# EAGLE design 4_TTL (EAGLE 7.6.0)
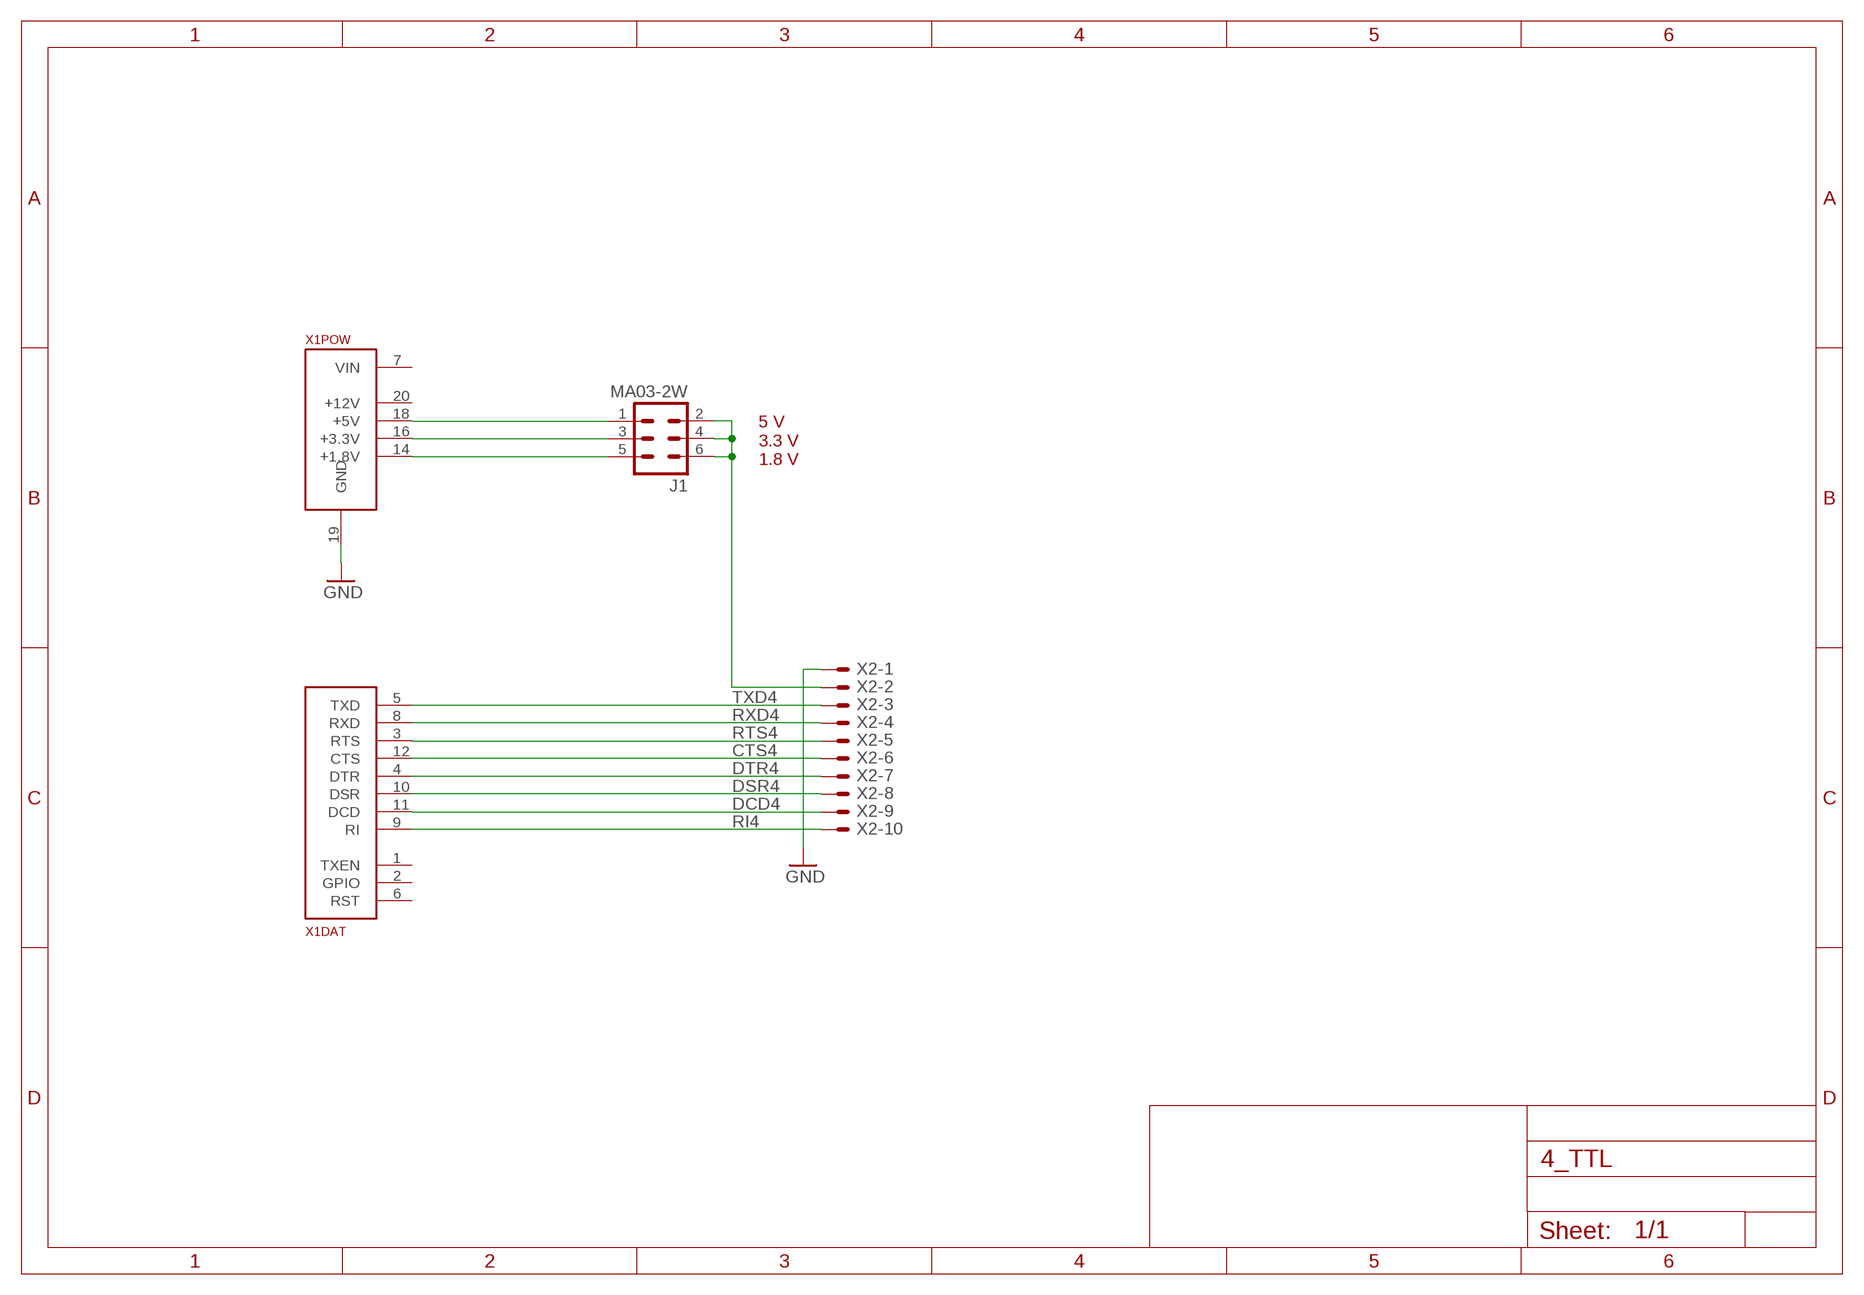
[diagram p0: schematic, sheet 1]

## Parts
J1  MA03-2W  [MA03-2W]
X1  ALLSERIALD  [DAUGHTER-THT]
X2  AKL18X-10W  [AKL182-10]

## Nets
CTS4: X1.12(DAT:CTS) X2.P$6
DCD4: X1.11(DAT:DCD) X2.P$9
DSR4: X1.10(DAT:DSR) X2.P$8
DTR4: X1.4(DAT:DTR) X2.P$7
GND: X1.19(POW:GND) X2.P$1
N$1: J1.2 J1.4 J1.6 X2.P$2
N$2: J1.5 X1.14(POW:+1.8V)
N$3: J1.3 X1.16(POW:+3.3V)
N$4: J1.1 X1.18(POW:+5V)
RI4: X1.9(DAT:RI) X2.P$10
RTS4: X1.3(DAT:RTS) X2.P$5
RXD4: X1.8(DAT:RXD) X2.P$4
TXD4: X1.5(DAT:TXD) X2.P$3
Unconnected: X1.1(DAT:TXEN) X1.2(DAT:GPIO) X1.6(DAT:RST) X1.7(POW:VIN) X1.20(POW:+12V)

## Notes on the sheet
- 5 V
  3.3 V
  1.8 V

## Library data of the parts
J1 = con-lstb:MA03-2W
X1 = AllSerial:ALLSERIAL
X2 = con-riacon_akl:AKL18X-10: Riacon AKL18X Steckverbinder 10-Pol Grid = 3,5mm

## Board
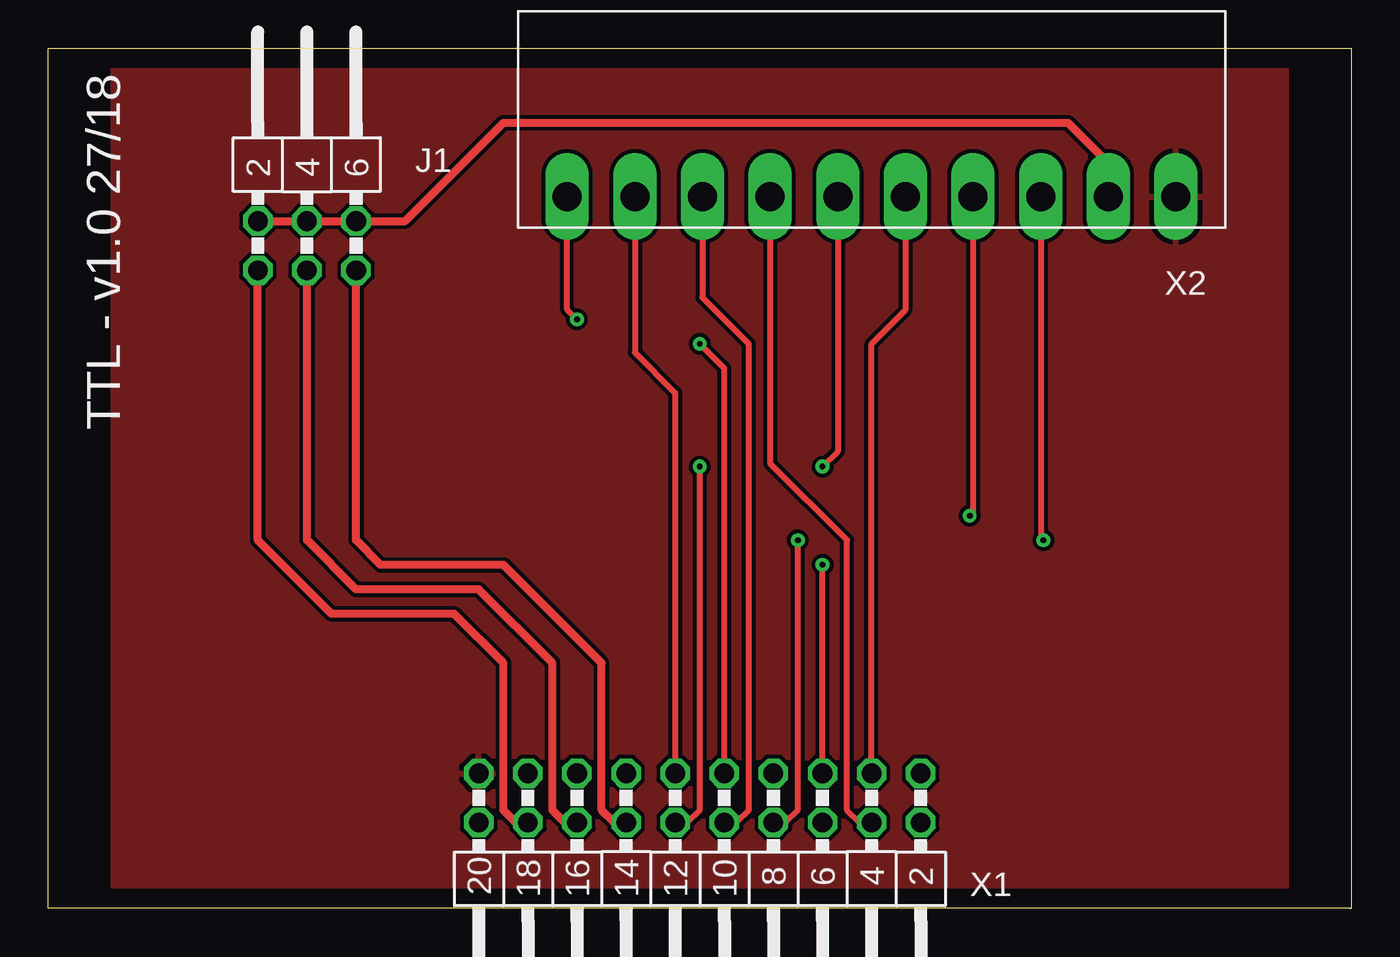
[diagram p1: board, top side]
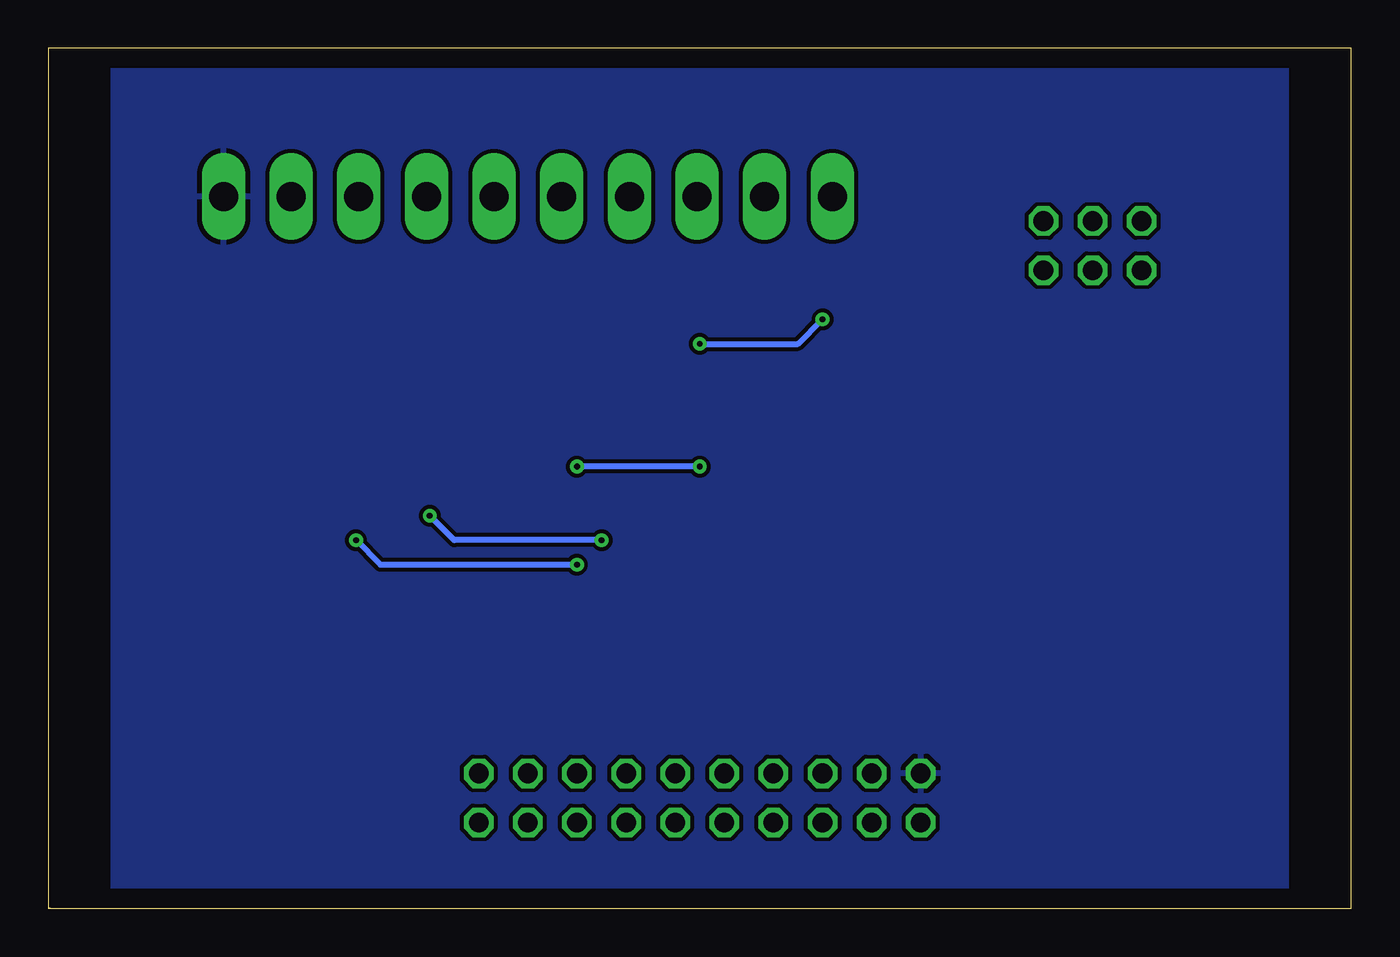
[diagram p2: board, bottom side, seen from below]

Size 67.4 x 44.5 mm. Coordinates in mm from the lower left corner, seen from the top.
Outline: 67.31,0 67.4,0
Copper layers (1*16): Top 0.035mm / dielectric 1.5mm / Bottom 0.035mm
Design rules "default *": minimum track width 10mil, minimum drill 24mil, track to track 8mil, track to pad 8mil, pad to pad 8mil, via to via 8mil, smd to smd 8mil, copper to edge 40mil, drill to drill 8mil, minimum pad ring 10mil, minimum via ring 8mil, stop-mask expansion 4mil, vias tented up to drill 0.3mm, thermal gap 10mil

### Footprints (pad centres in the part's own frame; a part is rotated, then mirrored left to right if it is on the bottom)
MA03-2W = drill 1.016 octagon: 1 -2.54,-1.27; 2 -2.54,1.27; 3 0,-1.27; 4 0,1.27; 5 2.54,-1.27; 6 2.54,1.27
DAUGHTER-THT = drill 1.016 octagon: 1 11.43,6.985; 2 11.43,4.445; 3 8.89,6.985; 4 8.89,4.445; 5 6.35,6.985; 6 6.35,4.445; 7 3.81,6.985; 8 3.81,4.445; 9 1.27,6.985; 10 1.27,4.445; 11 -1.27,6.985; 12 -1.27,4.445; 13 -3.81,6.985; 14 -3.81,4.445; 15 -6.35,6.985; 16 -6.35,4.445; 17 -8.89,6.985; 18 -8.89,4.445; 19 -11.43,6.985; 20 -11.43,4.445
AKL182-10 = drill 1.5 pad 2.184 long: P$1 -15.75,0; P$2 -12.25,0; P$3 -8.75,0; P$4 -5.25,0; P$5 -1.75,0; P$6 1.75,0; P$7 5.25,0; P$8 8.75,0; P$9 12.25,0; P$10 15.75,0

### Placement (x,y rotation side)
J1  13.38,34.29 0 top
X1  33.7,0 0 top
X2  42.59,36.83 180 top

### Tracks (layer width: path | path; a pad name or v marks a point on that pad's centre or on a via)
CTS4  (via drill 0.3)
  Top 0.305: X2.P$6 40.84,23.65 v40.05,22.86 | X1.12 33.07,4.45 33.7,5.08 v33.7,22.86
  Bottom 0.305: v33.7,22.86 v40.05,22.86
DCD4
  Top 0.305: X2.P$9 30.34,28.76 32.43,26.67 X1.11
DSR4
  Top 0.305: X1.10 35.61,4.45 36.24,5.08 36.24,29.21 33.84,31.61 X2.P$8
DTR4
  Top 0.305: X1.4 41.96,4.45 41.32,5.08 41.32,19.05 37.34,23.03 X2.P$7
GND
  pour Bottom: -0.59,44.45 67.99,44.45 67.99,0 -0.59,0
  pour Top: -0.59,0 67.99,0 67.99,44.45 -0.59,44.45
N$1
  Top 0.406: J1.2 J1.4 J1.6 18.46,35.56 23.54,40.64 52.75,40.64 54.84,38.55 X2.P$2
N$2
  Top 0.406: X1.14 29.26,4.45 28.62,5.08 28.62,12.7 23.54,17.78 17.19,17.78 15.92,19.05 J1.5
N$3
  Top 0.406: X1.16 26.72,4.45 26.08,5.08 26.08,12.7 22.27,16.51 15.92,16.51 13.38,19.05 J1.3
N$4
  Top 0.406: X1.18 24.18,4.45 23.54,5.08 23.54,12.7 21,15.24 14.65,15.24 10.84,19.05 J1.1
RI4  (via drill 0.3)
  Top 0.305: X1.9 34.97,27.94 v33.7,29.21 | v27.35,30.48 26.84,30.99 X2.P$10
  Bottom 0.305: v33.7,29.21 28.62,29.21 v27.35,30.48
RTS4
  Top 0.305: X1.3 42.59,29.21 44.34,30.96 X2.P$5
RXD4  (via drill 0.3)
  Top 0.305: X1.8 38.15,4.45 38.78,5.08 v38.78,19.05 | X2.P$4 47.84,20.49 v47.67,20.32
  Bottom 0.305: v38.78,19.05 46.4,19.05 v47.67,20.32
TXD4  (via drill 0.3)
  Top 0.305: X1.5 v40.05,17.78 | X2.P$3 51.34,19.19 v51.48,19.05
  Bottom 0.305: v40.05,17.78 50.21,17.78 v51.48,19.05

### Text on the board
tPlace: TTL - v1.0 27/18